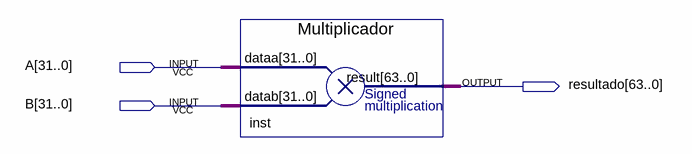
[diagram p0: schematic sheet]
// Quartus schematic testeMult.bdf as structural Verilog: 1 symbols, 3 pins
module testeMult (
  input  [31:0] A,
  input  [31:0] B,
  output [63:0] resultado
);

  Multiplicador inst (.dataa(A), .datab(B), .result(resultado));
endmodule
